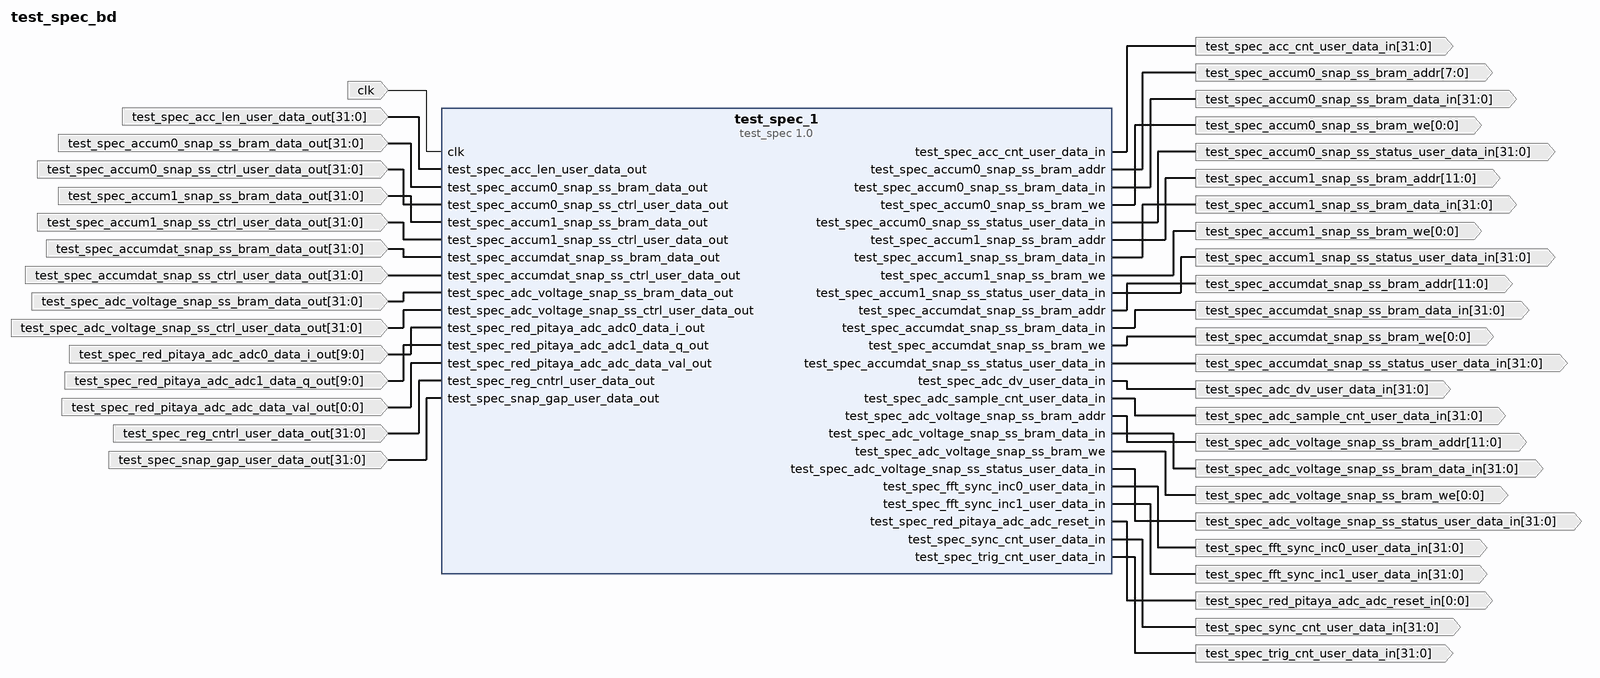
[diagram p0: block diagram of the top level]
# Vivado block design test_spec_bd, xc7z010clg400-1, Vivado 2021.1
create_bd_design test_spec_bd

create_bd_port -dir I -type clk clk
create_bd_port -dir O -from 31 -to 0 -type data test_spec_acc_cnt_user_data_in
create_bd_port -dir I -from 31 -to 0 -type data test_spec_acc_len_user_data_out
create_bd_port -dir O -from 7 -to 0 -type data test_spec_accum0_snap_ss_bram_addr
create_bd_port -dir O -from 31 -to 0 -type data test_spec_accum0_snap_ss_bram_data_in
create_bd_port -dir I -from 31 -to 0 -type data test_spec_accum0_snap_ss_bram_data_out
create_bd_port -dir O -from 0 -to 0 -type data test_spec_accum0_snap_ss_bram_we
create_bd_port -dir I -from 31 -to 0 -type data test_spec_accum0_snap_ss_ctrl_user_data_out
create_bd_port -dir O -from 31 -to 0 -type data test_spec_accum0_snap_ss_status_user_data_in
create_bd_port -dir O -from 11 -to 0 -type data test_spec_accum1_snap_ss_bram_addr
create_bd_port -dir O -from 31 -to 0 -type data test_spec_accum1_snap_ss_bram_data_in
create_bd_port -dir I -from 31 -to 0 -type data test_spec_accum1_snap_ss_bram_data_out
create_bd_port -dir O -from 0 -to 0 -type data test_spec_accum1_snap_ss_bram_we
create_bd_port -dir I -from 31 -to 0 -type data test_spec_accum1_snap_ss_ctrl_user_data_out
create_bd_port -dir O -from 31 -to 0 -type data test_spec_accum1_snap_ss_status_user_data_in
create_bd_port -dir O -from 11 -to 0 -type data test_spec_accumdat_snap_ss_bram_addr
create_bd_port -dir O -from 31 -to 0 -type data test_spec_accumdat_snap_ss_bram_data_in
create_bd_port -dir I -from 31 -to 0 -type data test_spec_accumdat_snap_ss_bram_data_out
create_bd_port -dir O -from 0 -to 0 -type data test_spec_accumdat_snap_ss_bram_we
create_bd_port -dir I -from 31 -to 0 -type data test_spec_accumdat_snap_ss_ctrl_user_data_out
create_bd_port -dir O -from 31 -to 0 -type data test_spec_accumdat_snap_ss_status_user_data_in
create_bd_port -dir O -from 31 -to 0 -type data test_spec_adc_dv_user_data_in
create_bd_port -dir O -from 31 -to 0 -type data test_spec_adc_sample_cnt_user_data_in
create_bd_port -dir O -from 11 -to 0 -type data test_spec_adc_voltage_snap_ss_bram_addr
create_bd_port -dir O -from 31 -to 0 -type data test_spec_adc_voltage_snap_ss_bram_data_in
create_bd_port -dir I -from 31 -to 0 -type data test_spec_adc_voltage_snap_ss_bram_data_out
create_bd_port -dir O -from 0 -to 0 -type data test_spec_adc_voltage_snap_ss_bram_we
create_bd_port -dir I -from 31 -to 0 -type data test_spec_adc_voltage_snap_ss_ctrl_user_data_out
create_bd_port -dir O -from 31 -to 0 -type data test_spec_adc_voltage_snap_ss_status_user_data_in
create_bd_port -dir O -from 31 -to 0 -type data test_spec_fft_sync_inc0_user_data_in
create_bd_port -dir O -from 31 -to 0 -type data test_spec_fft_sync_inc1_user_data_in
create_bd_port -dir I -from 9 -to 0 -type data test_spec_red_pitaya_adc_adc0_data_i_out
create_bd_port -dir I -from 9 -to 0 -type data test_spec_red_pitaya_adc_adc1_data_q_out
create_bd_port -dir I -from 0 -to 0 -type data test_spec_red_pitaya_adc_adc_data_val_out
create_bd_port -dir O -from 0 -to 0 -type data test_spec_red_pitaya_adc_adc_reset_in
create_bd_port -dir I -from 31 -to 0 -type data test_spec_reg_cntrl_user_data_out
create_bd_port -dir I -from 31 -to 0 -type data test_spec_snap_gap_user_data_out
create_bd_port -dir O -from 31 -to 0 -type data test_spec_sync_cnt_user_data_in
create_bd_port -dir O -from 31 -to 0 -type data test_spec_trig_cnt_user_data_in

create_bd_cell -type ip -vlnv User_Company:SysGen:test_spec:1.0 test_spec_1

# ---- connections ----

connect_bd_net [get_bd_ports clk] [get_bd_pins test_spec_1/clk]
connect_bd_net [get_bd_pins test_spec_1/test_spec_acc_cnt_user_data_in] [get_bd_ports test_spec_acc_cnt_user_data_in]
connect_bd_net [get_bd_pins test_spec_1/test_spec_accum0_snap_ss_bram_addr] [get_bd_ports test_spec_accum0_snap_ss_bram_addr]
connect_bd_net [get_bd_pins test_spec_1/test_spec_accum0_snap_ss_bram_data_in] [get_bd_ports test_spec_accum0_snap_ss_bram_data_in]
connect_bd_net [get_bd_pins test_spec_1/test_spec_accum0_snap_ss_bram_we] [get_bd_ports test_spec_accum0_snap_ss_bram_we]
connect_bd_net [get_bd_pins test_spec_1/test_spec_accum0_snap_ss_status_user_data_in] [get_bd_ports test_spec_accum0_snap_ss_status_user_data_in]
connect_bd_net [get_bd_pins test_spec_1/test_spec_accum1_snap_ss_bram_addr] [get_bd_ports test_spec_accum1_snap_ss_bram_addr]
connect_bd_net [get_bd_pins test_spec_1/test_spec_accum1_snap_ss_bram_data_in] [get_bd_ports test_spec_accum1_snap_ss_bram_data_in]
connect_bd_net [get_bd_pins test_spec_1/test_spec_accum1_snap_ss_bram_we] [get_bd_ports test_spec_accum1_snap_ss_bram_we]
connect_bd_net [get_bd_pins test_spec_1/test_spec_accum1_snap_ss_status_user_data_in] [get_bd_ports test_spec_accum1_snap_ss_status_user_data_in]
connect_bd_net [get_bd_pins test_spec_1/test_spec_accumdat_snap_ss_bram_addr] [get_bd_ports test_spec_accumdat_snap_ss_bram_addr]
connect_bd_net [get_bd_pins test_spec_1/test_spec_accumdat_snap_ss_bram_data_in] [get_bd_ports test_spec_accumdat_snap_ss_bram_data_in]
connect_bd_net [get_bd_pins test_spec_1/test_spec_accumdat_snap_ss_bram_we] [get_bd_ports test_spec_accumdat_snap_ss_bram_we]
connect_bd_net [get_bd_pins test_spec_1/test_spec_accumdat_snap_ss_status_user_data_in] [get_bd_ports test_spec_accumdat_snap_ss_status_user_data_in]
connect_bd_net [get_bd_pins test_spec_1/test_spec_adc_dv_user_data_in] [get_bd_ports test_spec_adc_dv_user_data_in]
connect_bd_net [get_bd_pins test_spec_1/test_spec_adc_sample_cnt_user_data_in] [get_bd_ports test_spec_adc_sample_cnt_user_data_in]
connect_bd_net [get_bd_pins test_spec_1/test_spec_adc_voltage_snap_ss_bram_addr] [get_bd_ports test_spec_adc_voltage_snap_ss_bram_addr]
connect_bd_net [get_bd_pins test_spec_1/test_spec_adc_voltage_snap_ss_bram_data_in] [get_bd_ports test_spec_adc_voltage_snap_ss_bram_data_in]
connect_bd_net [get_bd_pins test_spec_1/test_spec_adc_voltage_snap_ss_bram_we] [get_bd_ports test_spec_adc_voltage_snap_ss_bram_we]
connect_bd_net [get_bd_pins test_spec_1/test_spec_adc_voltage_snap_ss_status_user_data_in] \
  [get_bd_ports test_spec_adc_voltage_snap_ss_status_user_data_in]
connect_bd_net [get_bd_pins test_spec_1/test_spec_fft_sync_inc0_user_data_in] [get_bd_ports test_spec_fft_sync_inc0_user_data_in]
connect_bd_net [get_bd_pins test_spec_1/test_spec_fft_sync_inc1_user_data_in] [get_bd_ports test_spec_fft_sync_inc1_user_data_in]
connect_bd_net [get_bd_pins test_spec_1/test_spec_red_pitaya_adc_adc_reset_in] [get_bd_ports test_spec_red_pitaya_adc_adc_reset_in]
connect_bd_net [get_bd_pins test_spec_1/test_spec_sync_cnt_user_data_in] [get_bd_ports test_spec_sync_cnt_user_data_in]
connect_bd_net [get_bd_pins test_spec_1/test_spec_trig_cnt_user_data_in] [get_bd_ports test_spec_trig_cnt_user_data_in]
connect_bd_net [get_bd_ports test_spec_acc_len_user_data_out] [get_bd_pins test_spec_1/test_spec_acc_len_user_data_out]
connect_bd_net [get_bd_ports test_spec_accum0_snap_ss_bram_data_out] [get_bd_pins test_spec_1/test_spec_accum0_snap_ss_bram_data_out]
connect_bd_net [get_bd_ports test_spec_accum0_snap_ss_ctrl_user_data_out] [get_bd_pins test_spec_1/test_spec_accum0_snap_ss_ctrl_user_data_out]
connect_bd_net [get_bd_ports test_spec_accum1_snap_ss_bram_data_out] [get_bd_pins test_spec_1/test_spec_accum1_snap_ss_bram_data_out]
connect_bd_net [get_bd_ports test_spec_accum1_snap_ss_ctrl_user_data_out] [get_bd_pins test_spec_1/test_spec_accum1_snap_ss_ctrl_user_data_out]
connect_bd_net [get_bd_ports test_spec_accumdat_snap_ss_bram_data_out] [get_bd_pins test_spec_1/test_spec_accumdat_snap_ss_bram_data_out]
connect_bd_net [get_bd_ports test_spec_accumdat_snap_ss_ctrl_user_data_out] [get_bd_pins test_spec_1/test_spec_accumdat_snap_ss_ctrl_user_data_out]
connect_bd_net [get_bd_ports test_spec_adc_voltage_snap_ss_bram_data_out] [get_bd_pins test_spec_1/test_spec_adc_voltage_snap_ss_bram_data_out]
connect_bd_net [get_bd_ports test_spec_adc_voltage_snap_ss_ctrl_user_data_out] \
  [get_bd_pins test_spec_1/test_spec_adc_voltage_snap_ss_ctrl_user_data_out]
connect_bd_net [get_bd_ports test_spec_red_pitaya_adc_adc0_data_i_out] [get_bd_pins test_spec_1/test_spec_red_pitaya_adc_adc0_data_i_out]
connect_bd_net [get_bd_ports test_spec_red_pitaya_adc_adc1_data_q_out] [get_bd_pins test_spec_1/test_spec_red_pitaya_adc_adc1_data_q_out]
connect_bd_net [get_bd_ports test_spec_red_pitaya_adc_adc_data_val_out] [get_bd_pins test_spec_1/test_spec_red_pitaya_adc_adc_data_val_out]
connect_bd_net [get_bd_ports test_spec_reg_cntrl_user_data_out] [get_bd_pins test_spec_1/test_spec_reg_cntrl_user_data_out]
connect_bd_net [get_bd_ports test_spec_snap_gap_user_data_out] [get_bd_pins test_spec_1/test_spec_snap_gap_user_data_out]

validate_bd_design
save_bd_design
